# Altium schematic sheet Power_Input.SchDoc
size 149 x 100 mm; SheetNumber: 1; SheetTotal: 3
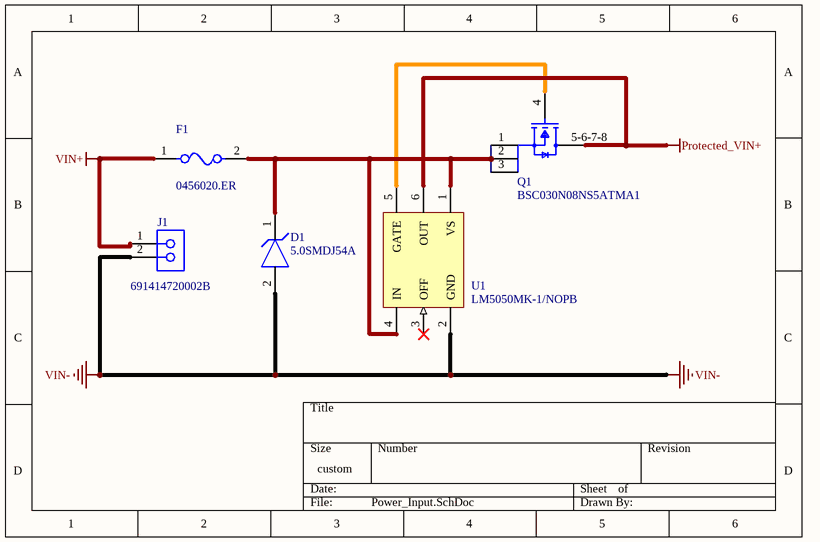
[diagram p0: Power_Input.SchDoc]

## Parts
D1  5.0SMDJ54A  [FP-5_0SMDJ-MFG]
F1  0456020.ER  [FP-0456-MFG]
J1  691414720002B  [691414720002B]
Q1  BSC030N08NS5ATMA1  [FP-PG-TDSON-8-MFG]
U1  LM5050MK-1/NOPB  [DDC0006A_N]

## Nets
Protected_VIN+: Q1.5-6-7-8(D) U1.6(OUT)
VIN+: F1.1 J1.1
VIN-: D1.2(A) J1.2 U1.2(GND)
NetD1_1: D1.1(C) F1.2 Q1.1(S) Q1.2(S) Q1.3(S) U1.1(VS) U1.4(IN)
NetQ1_4: Q1.4(G) U1.5(GATE)

Not connected (* = marked no-connect by the designer): U1 3(OFF)*

## Notes on the sheet
- Ochrona przed odwrotną polaryzacją.
  LM5050 nie otworzy tranzystora BSC gdy polaryzacja będzie odwrotna. Także jest to ochrona od prądu wstecznego, oraz redukcja ciepła bo BSC ma małą rezystancje w porównaniu do zwykłej diody prostowniczej.
  A dioda TVS chroni układ przed przepięciem zwierając prąd do masy po przekroczeniu 54V.

## Library data of the parts
D1 = CMP-08607-000114-1: TVS DIODE 54V 87.1V DO214AB; Peak Pulse Current: 57.5A; Number of Unidirectional Channels: 1; Test Current: 1mA; Polarity: Unidirectional; Peak Pulse Power: 5kW; Leakage Current: 5uA; Diode Type: ZENER; Breakdown Voltage: 60V; Power Line Protection: No; Packaging: Tape and Reel; Min Operating Temperature: -55°C; Max Operating Temperature: 150°C; Number of Pins: 2; Clamping Voltage: 87.1V; Mount: Surface Mount; Package Quantity: 3000; Case/Package: DO-214AB; Resistor Type: Zener; Lead Free: Lead Free; Operating Supply Voltage: 54V; Reverse Standoff Voltage: 54V; Min Breakdown Voltage: 60V; Termination: SMD/SMT; Number of Channels: 1; Max Surge Current: 57.5A; Reverse Breakdown Voltage: 60V; RoHS Compliant: Yes; Series: 5.0SMDJ; Number of Elements: 1
F1 = CMP-08605-000068-1: FUSE BOARD MNT 20A 125VAC 100VDC; Manufacturer: Littelfuse Inc; Fuse Interrupt Dc Current: 1000A; Fuse Voltage Drop: 64.7mV; Fuse Interrupt Ac Current: 300A; Fuse I2T: 18A2Sec; Max Fuse Dc Voltage: 100V; Voltage Rating: 125V; Value: 2.3mΩ; Fuse Blow Speed: Fast; RoHS: TRUE; Lead Free: Yes; Temperature Range High: +125°C; Device Class L3: unset; Octopart: https://octopart.com/0456020.er-littelfuse-7502596; Fuse Current: 20A; Digikey Description: FUSE BOARD MNT 20A 125VAC 100VDC; Category: Fuse; Temperature Range Low: -55°C; ComponentLink2URL: https://www.littelfuse.com/~/media/electronics/datasheets/fuses/littelfuse_fuse_456_datasheet.pdf.pdf; Automotive: No; Mouser Description: Surface Mount Fuses 125V 20A V/FA NANO2; Max Fuse Ac Voltage: 125V; Temperature: -55°C to +125°C; Manufacturer Part Number: 0456020.ER; Device Class L2: Fuses; Height: 3.05mm; Package: 0456; ComponentLink2Description: Datasheet; Device Class L1: Circuit Protection; Resistance: 2.3mΩ
J1 = CMP-1502-03072-3: Terminal Block, Wtb, 2Way, 28-14Awg Rohs Compliant: Yes; Stripping Length: -7mm; Number of Positions Per Level: 2; Voltage: 300V; Current: 15A; Wire Gauge (Max): 28AWG; Number of Levels: 1; Pitch: 5.0038mm; Wire Gauge (Min): 12AWG; Plating: Steel; Length: 14.3mm; Color: Grey, White; Width: 11mm; RoHS: Compliant; Max Operating Temperature: 105°C; Current Rating: 15A; Lead Pitch: 5mm; Termination: Screwless; Number of Contacts: 2; Packaging: Box; Contact Plating: Brass; Min Operating Temperature: -40°C; Housing Material: Nylon; Mount: Through Hole; Contact Material: Brass; Number of Pins: 2; Height: 12.9mm
Q1 = CMP-32901-000135-1: MOSFET N-CH 80V 100A 8TDSON; Manufacturer: Infineon; Typ Forward Diode Voltage: 0.9V; Drain To Source Resistance: 2.6mΩ; Number Of Channels: 1; Input Capacitace At Vds: 4300pF @ 40V; Transconductance: 110S; Pulse Drain Current: 400A; Reverse Recovery Time: 54ns; Gate To Source Voltage: 20V; Power Dissipation: 2.5W; Threshold Vgs Max: 3.8V; Rthja Max: 50K/W; Turn On Delay Time: 20ns; Reverse Recovery Charge: 94nC; Continuous Drain Current: 22A; Max Junction Temp: +150°C; Gate Charge At Vgs: 61nC @ 10V; Turn Off Delay Time: 43ns; Max Forward Diode Voltage: 1.1V; Depletion Mode: False; Threshold Vgs Min: 2.2V; Footprint Url: https://www.infineon.com/cms/en/product/packages/PG-TDSON/PG-TDSON-8-7/; Device Class L3: MOSFETs; Number Of N Channels: 1; Height: 1.1mm; Digikey Description: MOSFET N-CH 80V 100A 8TDSON; Octopart: https://octopart.com/bsc030n08ns5atma1-infineon-52825708; ComponentLink2URL: https://www.infineon.com/dgdl/Infineon-BSC030N08NS5-DS-v02_02-EN.pdf?fileId=5546d4624ad04ef9014aed52f4210acf; Category: Trans; Drain To Source Voltage: 80V; Package: PG-TDSON-8; Drain To Source Breakdown Voltage: 80V; Mouser Description: BSC030N08NS5ATMA1 N-Channel MOSFET, 100 A, 80 V BSC030N08NS5, 8-Pin TDSON Infineon; ComponentLink2Description: Datasheet; Device Class L1: Discrete Semiconductors; Device Class L2: Transistors; Automotive: No; Manufacturer Part Number: BSC030N08NS5ATMA1; RoHS: TRUE; Temperature Range Low: -55°C; Temperature: -55°C to +150°C; Lead Free: Yes; Temperature Range High: +150°C
U1 = CMP-0063-01524-2: High Side OR-ing FET Controller, 6-pin TSOT, 1000 Reel; Manufacturer: Texas Instruments; CompType: MiscPower; PowerWise: Y; PackageTopMarking: SZHB*XTT; Code_IPC: SOT26A-6; ComponentLink1URL: http://www.ti.com/general/docs/lit/getliterature.tsp?genericPartNumber=LM5050-1&fileType=pdf; PinCount: 6; RoHS: Y; PartNumber: LM5050MK-1/NOPB; ComponentLink1Description: Datasheet URL; Code_JEDEC: MO-193-AA; PackageDescription: Molded TSOT, 2.97 x 1.65 x 0.87mm Body, 6 Lead, 0.95mm Pitch; High-Reliability: Y; PackageReference: DDC0006A